# EAGLE design Prototype (EAGLE 9.3.1)
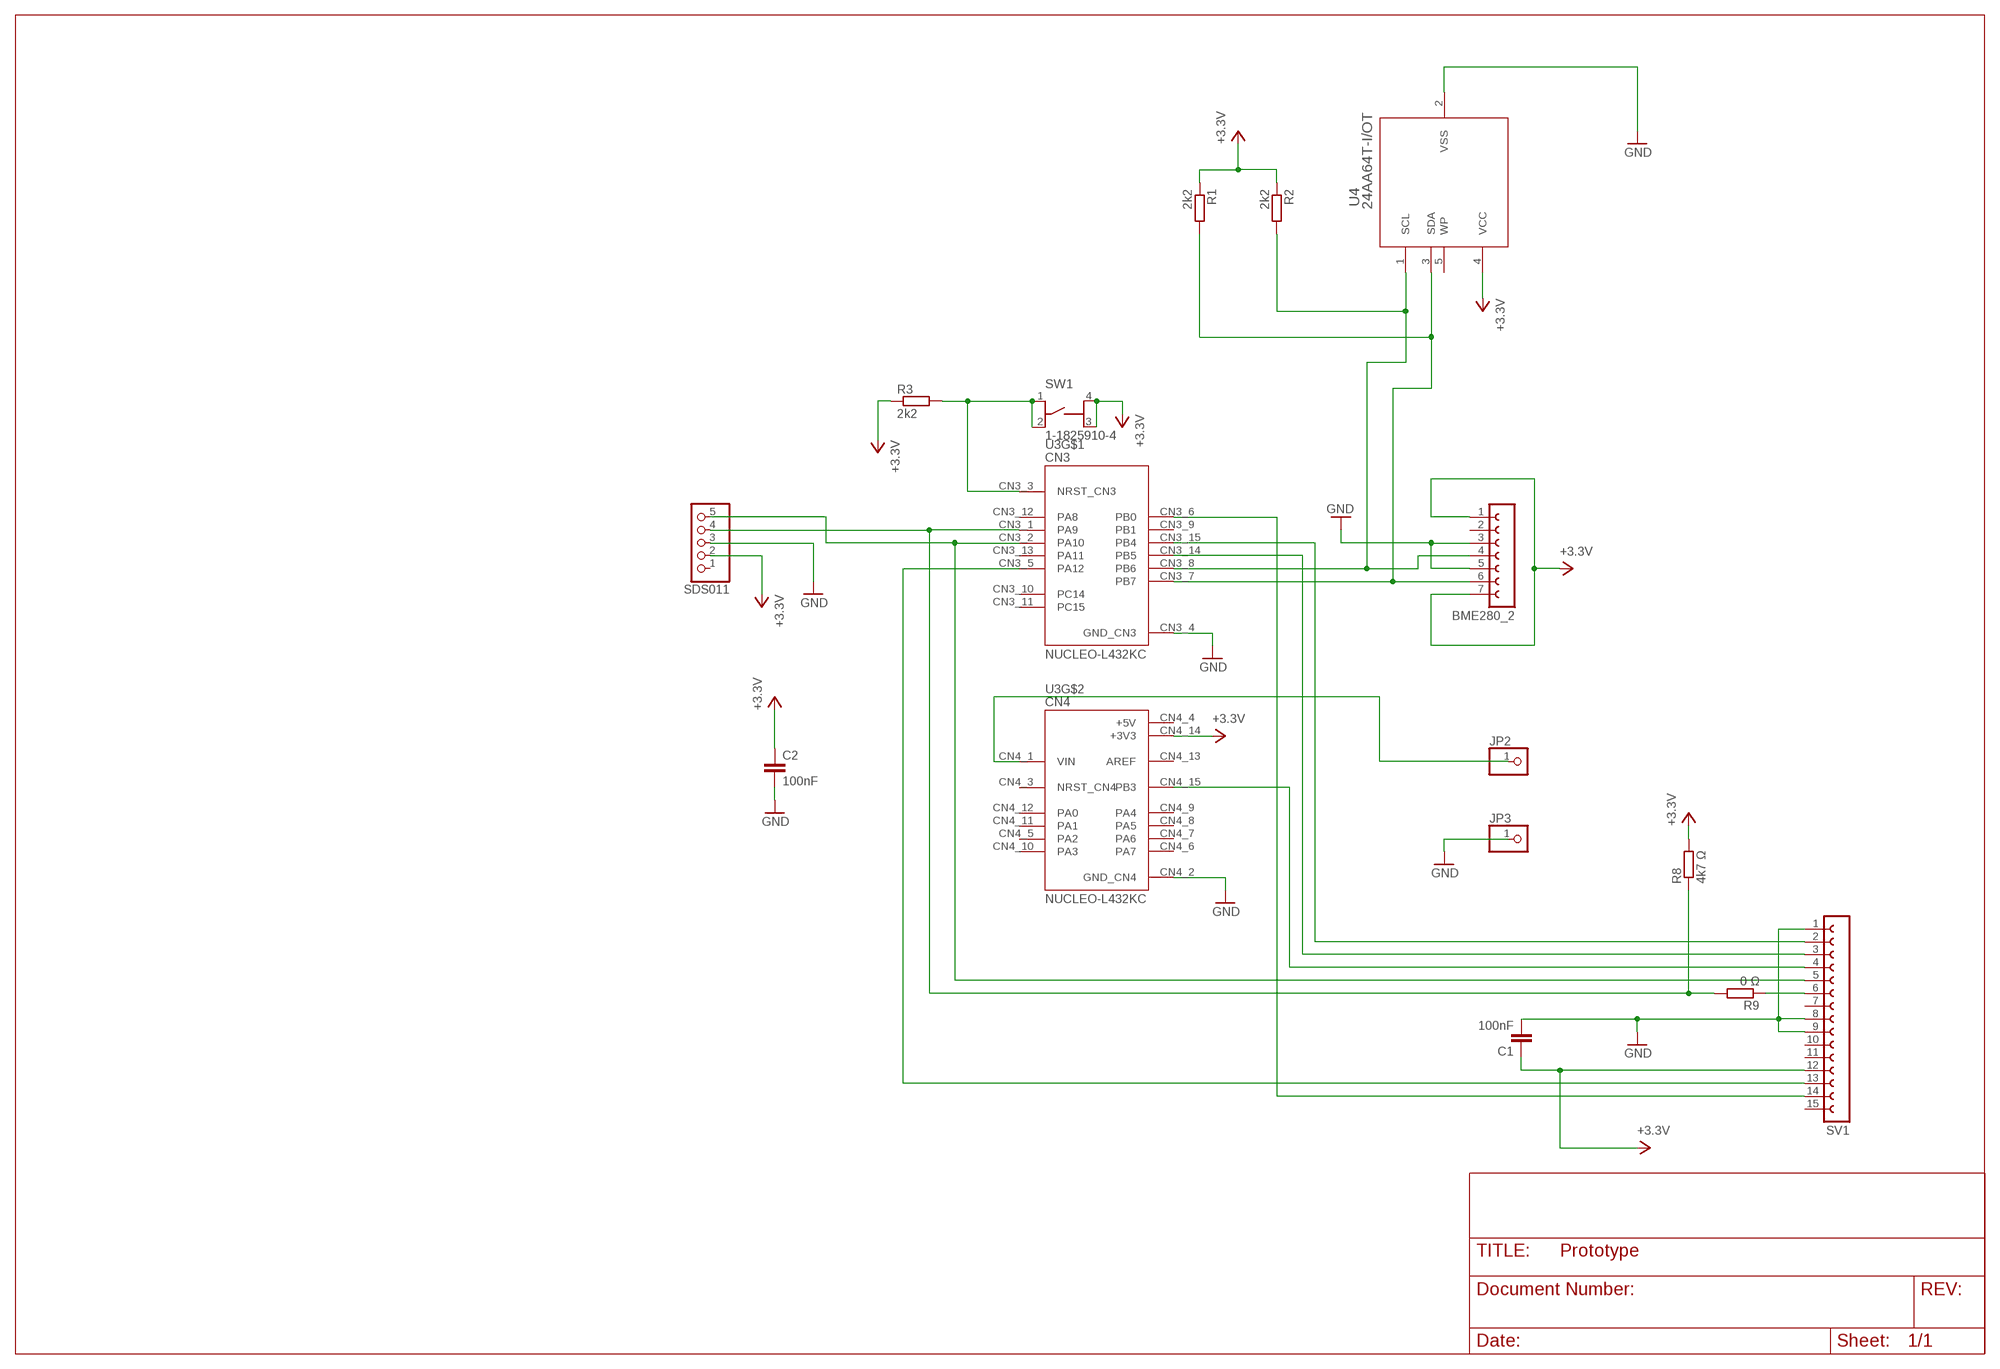
[diagram p0: schematic, sheet 1]

## Parts
BME280_2  FE07-1  [FE07]
C1  100nF  C-EUC0603K  [C0603K]
C2  100nF  C-EUC0603K  [C0603K]
JP2  PINHD-1X1  [1X01]
JP3  PINHD-1X1  [1X01]
R1  2k2  R-EU_R1206W  [R1206W]
R2  2k2  R-EU_R1206W  [R1206W]
R3  2k2  R-EU_R1206W  [R1206W]
R8  4k7 Ω  R-EU_R1206W  [R1206W]
R9  0 Ω  R-EU_R1206W  [R1206W]
SDS011  PINHD-1X5  [1X05]
SV1  FE15-1  [FE15]
SW1  1-1825910-4  [TE_1-1825910-4]
U3  NUCLEO-L432KC  [MODULE_NUCLEO-L432KC]
U4  24AA64T-I/OT  [SOT-23-5_MC]

## Nets
GND: BME280_2.3 BME280_2.5 C1.2 C2.2 JP3.1 SDS011.3 SV1.1 SV1.8 SV1.9 U3.CN3_4(GND_CN3) U3.CN4_2(GND_CN4) U4.2(VSS)
N$1: SDS011.5 SV1.5 U3.CN3_2(PA10)
N$3: SV1.14 U3.CN3_6(PB0)
N$4: BME280_2.4 R2.2 U3.CN3_8(PB6) U4.1(SCL)
N$5: R3.2 SW1.1 SW1.2 U3.CN3_3(NRST_CN3)
N$13: JP2.1 U3.CN4_1(VIN)
N$14: SV1.13 U3.CN3_5(PA12)
N$15: R8.1 R9.2 SDS011.4 U3.CN3_1(PA9)
N$17: SV1.3 U3.CN3_14(PB5)
N$19: SV1.2 U3.CN3_15(PB4)
N$20: SV1.4 U3.CN4_15(PB3)
N$23: BME280_2.6 R1.2 U3.CN3_7(PB7) U4.3(SDA)
N$25: R9.1 SV1.6
VCC: BME280_2.1 BME280_2.7 C1.1 C2.1 R1.1 R2.1 R3.1 R8.2 SDS011.2 SV1.12 SW1.3 SW1.4 U3.CN4_14(+3V3) U4.4(VCC) ; supply symbol labelled +3.3V
Unconnected: BME280_2.2 SDS011.1 SV1.7 SV1.10 SV1.11 SV1.15 U3.CN3_9(PB1) U3.CN3_10(PC14) U3.CN3_11(PC15) U3.CN3_12(PA8) U3.CN3_13(PA11) U3.CN4_3(NRST_CN4) U3.CN4_5(PA2) U3.CN4_6(PA7) U3.CN4_7(PA6) U3.CN4_8(PA5) U3.CN4_9(PA4) U3.CN4_10(PA3) U3.CN4_11(PA1) U3.CN4_12(PA0) U3.CN4_13(AREF) U4.5(WP)

## Power pins joined to a net without a drawn wire
+5V: U3.CN4_4(+5V)

## Library data of the parts
BME280_2 = con-lsta:FE07-1: FEMALE HEADER; OC_FARNELL: unknown; OC_NEWARK: unknown
C1 C2 = rcl:C-EU: CAPACITOR, European symbol; SPICEPREFIX: C
JP2 JP3 = pinhead:PINHD-1X1: PIN HEADER
R1-R3 R8 R9 = rcl:R-EU_: RESISTOR, European symbol; SPICEPREFIX: R
SDS011 = pinhead:PINHD-1X5: PIN HEADER
SV1 = con-lsta:FE15-1: FEMALE HEADER; OC_FARNELL: unknown; OC_NEWARK: unknown
SW1 = 1-1825910-4:1-1825910-4: Switch Tactile OFF (ON) SPST Round Button PC Pins 0.05A 24VDC 100000Cycles 1.56N Thru-Hole Loose; AVAILABILITY: Unavailable; DESCRIPTION: Tactile Switch SPST-NO Top Actuated Through Hole; MF: TE Connectivity; MP: 118259104; PACKAGE: None; PRICE: None; TE_PURCHASE_URL: https://www.te.com/usa-en/product-118259104.html?te_bu=Cor&te_type=disp&te_campaign=seda_glo_cor-seda-global-disp-prtnr-fy19-seda-model-bom-cta_sma-317_1&elqCampaignId=32493
U3 = NUCLEO-L432KC:NUCLEO-L432KC: STM32 Nucleo-32 development board with STM32L432KC MCU, supports Arduino connectivity; AVAILABILITY: Unavailable; DESCRIPTION: STM32L432KC, mbed-Enabled Development Nucleo-32 STM32L4 ARM® Cortex®-M4 MCU 32-Bit Embedded Evaluation Board; MF: STMicroelectronics; MP: NUCLEO-L432KC; PACKAGE: None; PRICE: None
U4 = 24AA64:24AA64T-I/OT; BUILT_BY: EMA_Jessica; COPYRIGHT: Copyright (C) 2018 Accelerated Designs. All rights reserved; MANUFACTURER_PART_NUMBER: 24AA64T-I/OT; VENDOR: Microchip

## Board
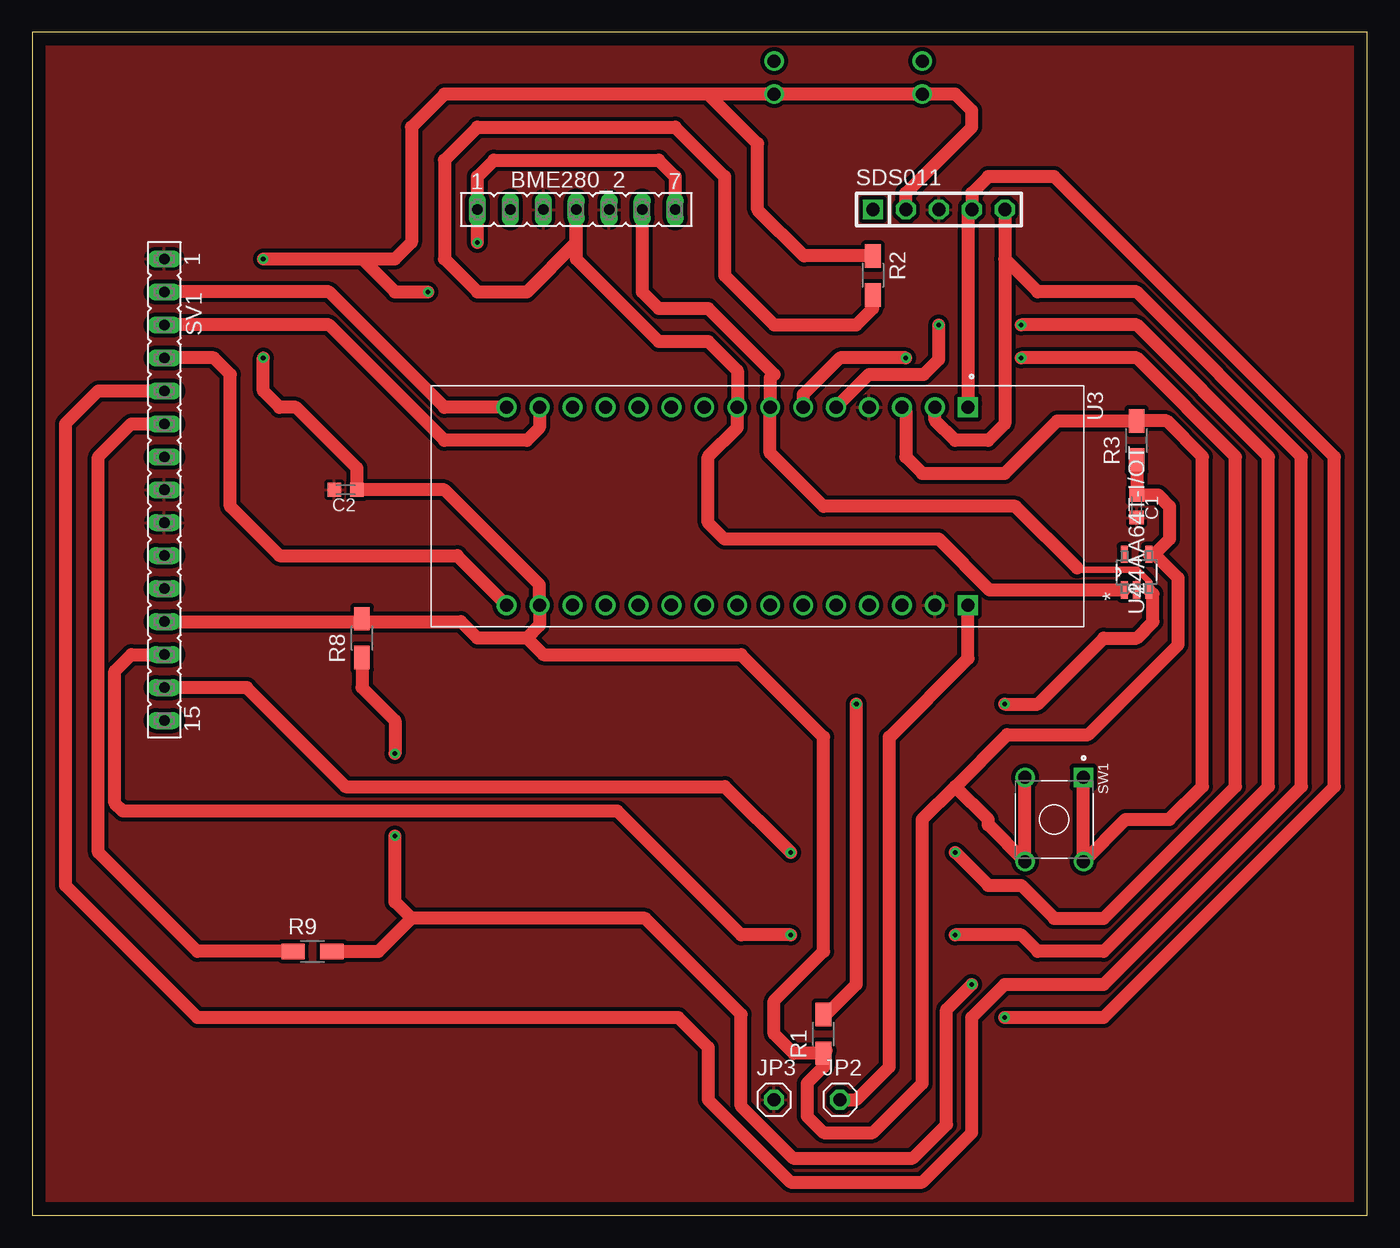
[diagram p1: board, top side]
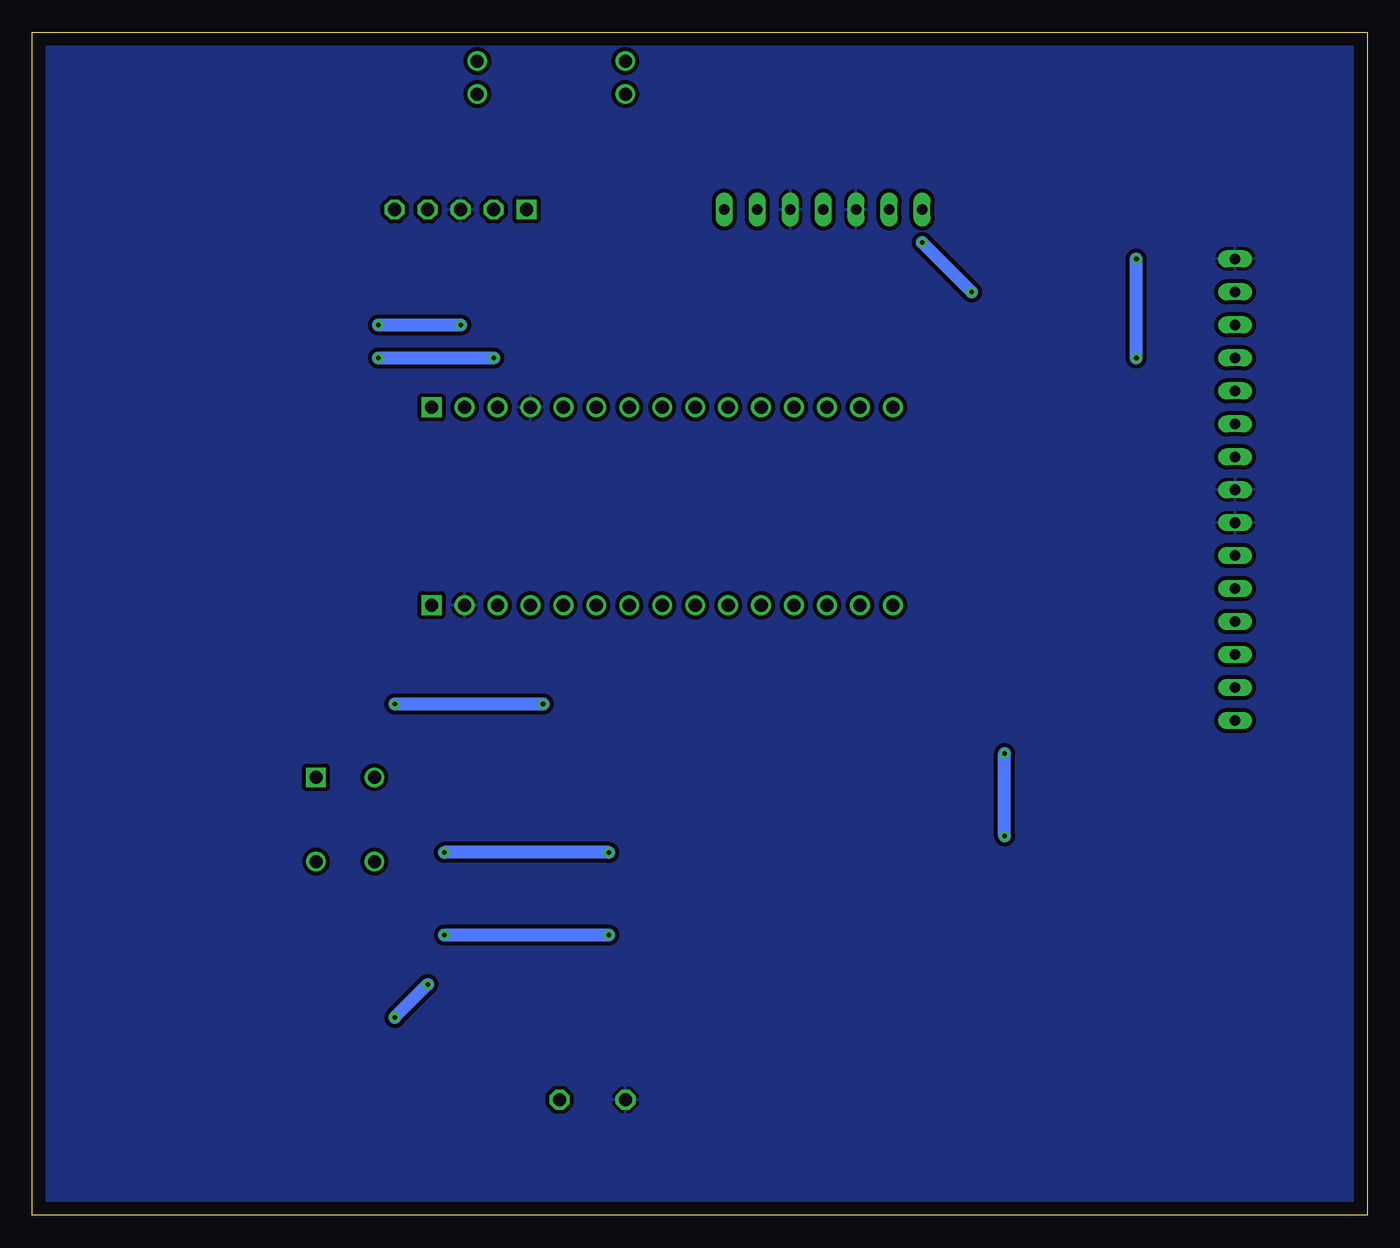
[diagram p2: board, bottom side, seen from below]

Size 102.85 x 91.11 mm. Coordinates in mm from the lower left corner, seen from the top.
Outline: 0,0 102.85,0 102.85,91.11 0,91.11 0,0
Copper layers (1*16): Top 0.035mm / dielectric 1.5mm / Bottom 0.035mm
Design rules "default": minimum track width 6mil, minimum drill 0.35mm, track to track 6mil, track to pad 6mil, pad to pad 6mil, via to via 6mil, smd to smd 6mil, copper to edge 40mil, drill to drill 6mil, minimum pad ring 10mil, minimum via ring 8mil, stop-mask expansion 4mil, vias tented up to drill 0mil, thermal gap 10mil

### Footprints (pad centres in the part's own frame; a part is rotated, then mirrored left to right if it is on the bottom)
FE07 = drill 0.813 long: 1 -7.62,0; 2 -5.08,0; 3 -2.54,0; 4 0,0; 5 2.54,0; 6 5.08,0; 7 7.62,0
C0603K = smd 1.05 x 1.08: 1 -0.875,0; 2 0.875,0
1X01 = drill 1.016 octagon: 1 0,0
R1206W = smd 1.8 x 1.2: 1 -1.499,0; 2 1.499,0
1X05 = drill 1.016 square: 1 -5.08,0 | drill 1.016 octagon: 2 -2.54,0; 3 0,0; 4 2.54,0; 5 5.08,0
FE15 = drill 0.813 long: 1 -17.78,0; 2 -15.24,0; 3 -12.7,0; 4 -10.16,0; 5 -7.62,0; 6 -5.08,0; 7 -2.54,0; 8 0,0; 9 2.54,0; 10 5.08,0; 11 7.62,0; 12 10.16,0; 13 12.7,0; 14 15.24,0; 15 17.78,0
TE_1-1825910-4 = drill 0.99 square: 1 -3.25,2.25 | drill 0.99: 2 3.25,2.25; 3 -3.25,-2.25; 4 3.25,-2.25
MODULE_NUCLEO-L432KC = drill 1.02 square: CN3_1 -7.62,16.215; CN4_1 7.62,16.215 | drill 1.02: CN3_2 -7.62,13.675; CN3_3 -7.62,11.135; CN3_4 -7.62,8.595; CN3_5 -7.62,6.055; CN3_6 -7.62,3.515; CN3_7 -7.62,0.975; CN3_8 -7.62,-1.565; CN3_9 -7.62,-4.105; CN3_10 -7.62,-6.645; CN3_11 -7.62,-9.185; CN3_12 -7.62,-11.725; CN3_13 -7.62,-14.265; CN3_14 -7.62,-16.805; CN3_15 -7.62,-19.345; CN4_2 7.62,13.675; CN4_3 7.62,11.135; CN4_4 7.62,8.595; CN4_5 7.62,6.055; CN4_6 7.62,3.515; CN4_7 7.62,0.975; CN4_8 7.62,-1.565; CN4_9 7.62,-4.105; CN4_10 7.62,-6.645; CN4_11 7.62,-9.185; CN4_12 7.62,-11.725; CN4_13 7.62,-14.265; CN4_14 7.62,-16.805; CN4_15 7.62,-19.345
SOT-23-5_MC = smd 1.321 x 0.559: 1 -1.372,0.95; 2 -1.372,0; 3 -1.372,-0.95; 4 1.372,-0.95; 5 1.372,0.95

### Placement (x,y rotation side)
BME280_2  41.91,77.47 0 top
C1  85.09,54.61 270 top
C2  24.13,55.88 180 top
JP2  62.23,8.89 0 top
JP3  57.15,8.89 0 top
R1  60.96,13.97 90 top
R2  64.77,72.39 270 top
R3  85.09,59.69 90 top
R8  25.4,44.45 90 top
R9  21.59,20.32 0 top
SDS011  69.85,77.47 0 top
SV1  10.16,55.88 270 top
SW1  78.74,30.48 270 top
U3  55.88,54.61 270 top
U4  85.09,49.53 90 top

### Tracks (layer width: path | path; a pad name or v marks a point on that pad's centre or on a via)
GND
  pour Top (isolate 0.305): 0.02,0.02 0.02,91.08 102.82,91.08 102.82,0.02
  pour Bottom (isolate 0.305): 0.02,0.02 0.02,91.08 102.82,91.08 102.82,0.02
N$1
  Top 1.016: SV1.5 5.08,63.5 2.54,60.96 2.54,25.4 12.7,15.24 49.76,15.24 52.07,12.93 52.07,8.89 58.42,2.54 68.58,2.54 72.39,6.35 72.39,15.24 74.93,17.78 82.55,17.78 97.79,33.02 97.79,58.42 85.09,71.12 77.47,71.12 74.93,73.66 | SDS011.5 74.93,73.66 | 74.93,73.66 74.93,60.96 73.66,59.69 71.12,59.69 69.56,61.26 U3.CN3_2
N$3  (via drill 0.35)
  Top 1.016: SV1.14 16.51,40.64 24.13,33.02 53.34,33.02 v58.42,27.94 | v67.31,66.04 62.23,66.04 59.4,63.2 U3.CN3_6 | v76.2,66.04 85.09,66.04 92.71,58.42 92.71,33.02 82.55,22.86 78.74,22.86 76.2,25.4 73.66,25.4 v71.12,27.94
  Bottom 1.016: v76.2,66.04 v67.31,66.04 | v58.42,27.94 v71.12,27.94
N$4
  Top 1.016: U4.1 73.76,48.16 69.85,52.07 53.34,52.07 52.07,53.34 52.07,58.42 54.31,60.66 U3.CN3_8 54.31,65.06 52.07,67.31 48.26,67.31 41.91,73.66 BME280_2.4 41.91,74.93 38.1,71.12 34.29,71.12 31.75,73.66 31.75,81.28 34.29,83.82 49.53,83.82 53.34,80.01 53.34,72.39 57.15,68.58 63.5,68.58 64.77,69.85 R2.2
N$5
  Top 1.016: R3.2 84.86,60.96 | U3.CN3_3 67.31,61.94 67.31,58.42 68.58,57.15 74.93,57.15 78.97,61.19 R3.2 | R3.2 87.4,61.19 90.17,58.42 90.17,33.02 87.63,30.48 84.24,30.48 SW1.2 SW1.1
N$13
  Top 1.016: JP2.1 63.5,8.89 66.04,11.43 66.04,36.83 72.09,42.88 U3.CN4_1
N$14  (via drill 0.35)
  Top 1.016: SV1.13 7.62,43.18 6.35,41.91 6.35,31.75 6.99,31.11 45.09,31.11 54.61,21.59 v58.42,21.59 | U3.CN3_5 64.47,64.76 68.69,64.76 69.85,65.92 v69.85,68.58 | v76.2,68.58 85.09,68.58 95.25,58.42 95.25,33.02 82.55,20.32 77.47,20.32 76.2,21.59 v71.12,21.59
  Bottom 1.016: v76.2,68.58 v69.85,68.58 | v71.12,21.59 v58.42,21.59
N$15  (via drill 0.35)
  Top 1.016: R8.1 25.4,40.64 27.94,38.1 v27.94,35.56 | 29.21,22.86 27.94,24.13 v27.94,29.21 | 72.39,62.52 U3.CN3_1 72.09,77.17 SDS011.4 72.39,78.74 73.66,80.01 78.74,80.01 100.33,58.42 100.33,33.02 82.55,15.24 v74.93,15.24 | v72.39,17.78 70.44,15.83 70.44,6.98 67.85,4.39 58.63,4.39 54.61,8.4 54.61,15.47 47.22,22.86 29.21,22.86 | R9.2 26.67,20.32 29.21,22.86
  Bottom 1.016: v72.39,17.78 v74.93,15.24 | v27.94,29.21 v27.94,35.56
N$16  (via drill 1)
  other vias: 57.15,88.9
N$17
  Top 1.016: U3.CN3_14 39.08,60.66 38.1,59.69 31.75,59.69 22.86,68.58 SV1.3
N$19
  Top 1.016: U3.CN3_15 31.75,62.23 22.86,71.12 SV1.2
N$20
  Top 1.016: SV1.4 13.97,66.04 15.24,64.77 15.24,54.61 19.05,50.8 32.73,50.8 U3.CN4_15
N$23  (via drill 0.35)
  Top 0.508: U4.3 86.04,48.82 85.15,49.71 80.66,49.71 80.51,49.86
  Top 1.016: BME280_2.6 46.99,71.12 48.26,69.85 52.07,69.85 57.15,64.77 56.85,64.47 U3.CN3_7 56.85,58.72 60.96,54.61 75.76,54.61 80.51,49.86 | R1.2 61.19,15.47 63.5,17.78 v63.5,39.37 | U4.3 86.36,47.84 86.36,45.72 85.09,44.45 82.55,44.45 77.47,39.37 v74.93,39.37
  Bottom 1.016: v63.5,39.37 v74.93,39.37
N$25
  Top 1.016: R9.1 12.7,20.32 5.08,27.94 5.08,58.42 7.62,60.96 SV1.6
N$26  (via drill 1)
  other vias: 68.58,88.9
VCC  (via drill 0.35, 1)
  Top 1.016: SV1.12 25.17,45.72 R8.2 25.63,45.72 33.02,45.72 34.29,44.45 38.1,44.45 | R3.1 C1.1 86.75,55.48 87.63,54.61 87.63,52.07 86.46,50.9 | 86.46,50.9 U4.4 | 86.46,50.9 88.3,49.07 88.3,43.95 81.36,37.01 75.11,37.01 71.12,33.02 | 52.07,86.36 31.75,86.36 29.21,83.82 29.21,74.93 27.94,73.66 25.4,73.66 | 38.1,44.45 39.08,45.42 U3.CN4_14 39.08,48.55 31.75,55.88 C2.1 25,57.55 20.32,62.23 19.05,62.23 17.78,63.5 v17.78,66.04 | R1.1 61.19,12.7 | R1.1 60.96,11.43 59.69,10.16 59.69,7.62 60.96,6.35 64.77,6.35 68.58,10.16 68.58,30.48 71.12,33.02 | v17.78,73.66 25.4,73.66 | R1.1 58.65,12.47 57.15,13.97 57.15,16.51 60.96,20.32 60.96,36.83 54.61,43.18 39.37,43.18 38.1,44.45 | BME280_2.7 49.53,80.01 48.26,81.28 35.56,81.28 34.29,80.01 BME280_2.1 v34.29,74.93 | 25.4,73.66 27.94,71.12 v30.48,71.12 | R2.1 59.46,73.89 55.88,77.47 55.88,82.55 52.07,86.36 | SDS011.2 67.31,78.74 72.39,83.82 72.39,85.09 71.12,86.36 v68.58,86.36 v57.15,86.36 52.07,86.36 | SW1.3 SW1.4 73.66,30.06 73.66,30.48 71.12,33.02
  Bottom 1.016: v17.78,66.04 v17.78,73.66 | v30.48,71.12 v34.29,74.93